# Altium schematic sheet SCH - Inputs and Intermediary.SchDoc: *f
size A4; CompanyName: James Cook University; DrawnBy1: Jacob Finger; Organization: James Cook University; Title1: AS1 SCH - Input & Intermediaries; Revision: 1.2; SheetNumber: 1; SheetTotal: 3; Title2: Conx, Headers, MCU & Flash; DrawnBy2: Liam McLaren; ProjectName: *ProjectName
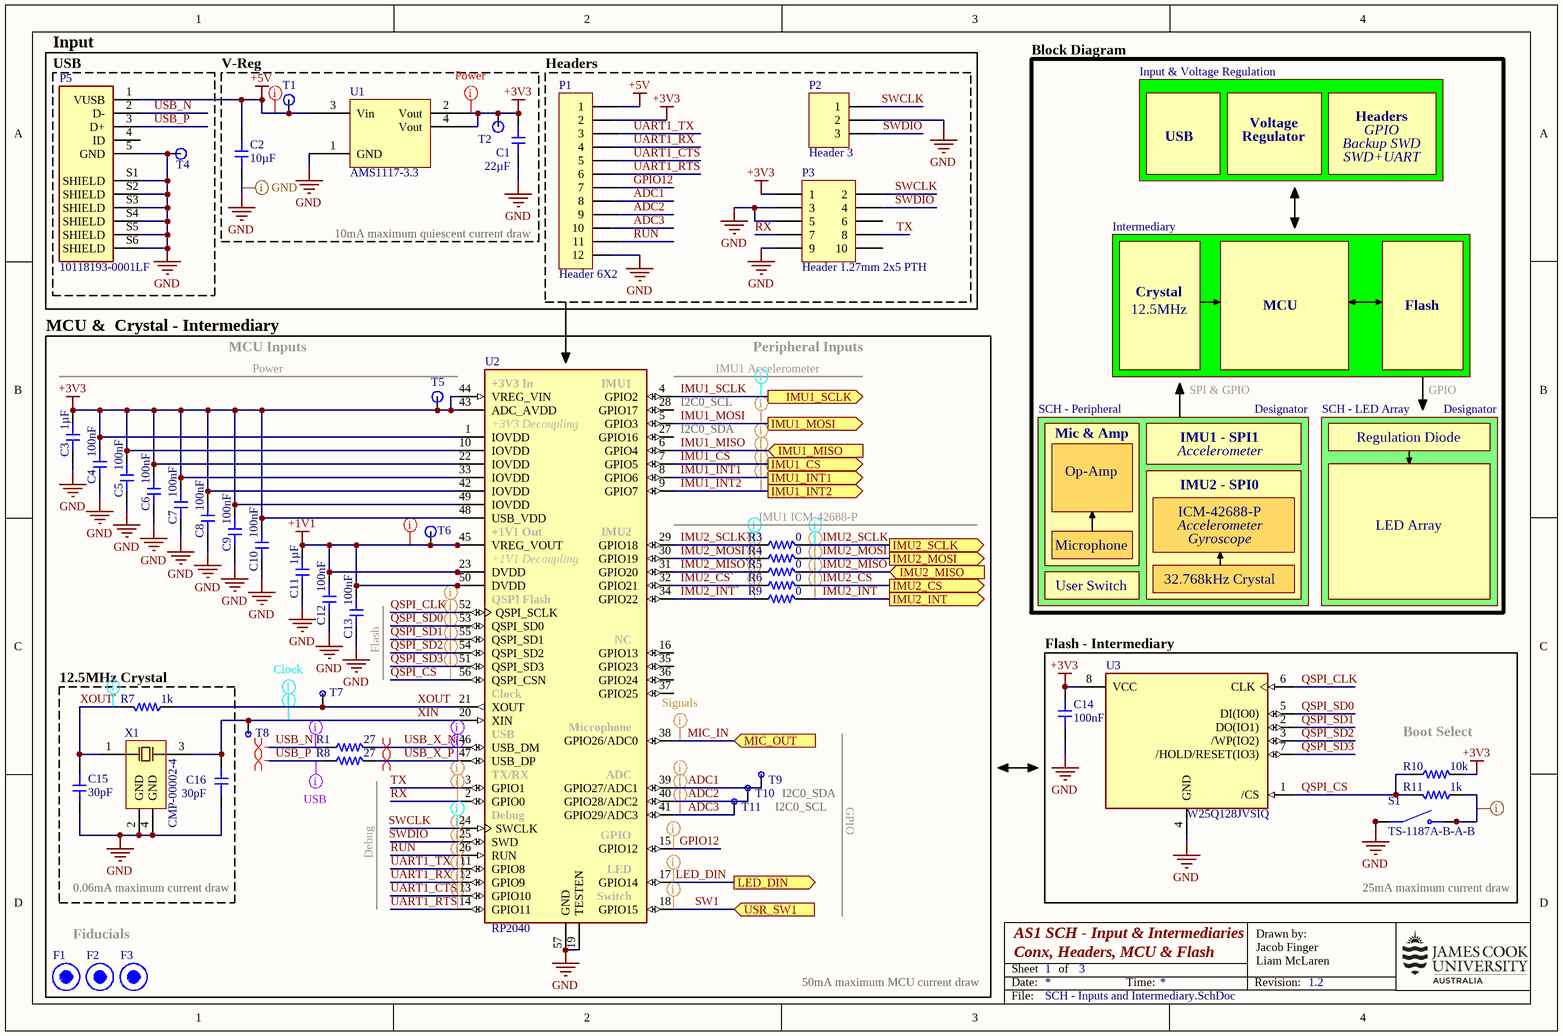
[diagram p0: SCH - Inputs and Intermediary.SchDoc]

## Parts
C1  value 22µF  [CAP-0603]  (hidden comment: CL10A226MQ8NRNC)
C2  value 10µF  [CAP-0402]  (hidden comment: CL05A106MQ5NUNC)
C3  value 1µF  [CAP-0402]  (hidden comment: CL05A105KA5NQNC)
C4  value 100nF  [CAP-0402]  (hidden comment: CL05B104KB54PNC)
C5  value 100nF  [CAP-0402]  (hidden comment: CL05B104KB54PNC)
C6  value 100nF  [CAP-0402]  (hidden comment: CL05B104KB54PNC)
C7  value 100nF  [CAP-0402]  (hidden comment: CL05B104KB54PNC)
C8  value 100nF  [CAP-0402]  (hidden comment: CL05B104KB54PNC)
C9  value 100nF  [CAP-0402]  (hidden comment: CL05B104KB54PNC)
C10  value 100nF  [CAP-0402]  (hidden comment: CL05B104KB54PNC)
C11  value 1µF  [CAP-0402]  (hidden comment: CL05A105KA5NQNC)
C12  value 100nF  [CAP-0402]  (hidden comment: CL05B104KB54PNC)
C13  value 100nF  [CAP-0402]  (hidden comment: CL05B104KB54PNC)
C14  value 100nF  [CAP-0402]  (hidden comment: CL05B104KB54PNC)
C15  value 30pF  [CAP-0603]  (hidden comment: 0603CG300J500NT)
C16  value 30pF  [CAP-0603]  (hidden comment: 0603CG300J500NT)
F1  Fiducial Pad  [Fiducial]  (value not drawn)  (no BOM)
F2  Fiducial Pad  [Fiducial]  (value not drawn)  (no BOM)
F3  Fiducial Pad  [Fiducial]  (value not drawn)  (no BOM)
P1  Header 6X2  [HDR2X6]  (no BOM)
P2  Header 3  [HDR1X3]  (no BOM)
P3  Header 1.27mm 2x5 PTH  [Header 1.27mm 2x5 PTH]  (no BOM)
P5  10118193-0001LF  [FCI_10118193-0001LF]
R1  value 27  [RES-0603]  (hidden comment: 0603WAF270JT5E)
R3  value 0  [RES-0402]  (hidden comment: 0402WGF0000TCE)
R4  value 0  [RES-0402]  (hidden comment: 0402WGF0000TCE)
R5  value 0  [RES-0402]  (hidden comment: 0402WGF0000TCE)
R6  value 0  [RES-0402]  (hidden comment: 0402WGF0000TCE)
R7  value 1k  [RES-0402]  (hidden comment: 0402WGF1001TCE)
R8  value 27  [RES-0603]  (hidden comment: 0603WAF270JT5E)
R9  value 0  [RES-0402]  (hidden comment: 0402WGF0000TCE)
R10  value 10k  [RES-0402]  (hidden comment: 0402WGF1002TCE)
R11  value 1k  [RES-0402]  (hidden comment: 0402WGF1001TCE)
S1  TS-1187A-B-A-B  [SW_TS-1187A-B-A-B]
T1  TP  [TestPoint]  (value not drawn)  (no BOM)
T2  TP  [TestPoint]  (value not drawn)  (no BOM)
T4  TP  [TestPoint]  (value not drawn)  (no BOM)
T5  TP  [TestPoint]  (value not drawn)  (no BOM)
T6  TP  [TestPoint]  (value not drawn)  (no BOM)
T7  TP  [TestPoint - Small]  (value not drawn)  (no BOM)
T8  TP  [TestPoint - Small]  (value not drawn)  (no BOM)
T9  TP  [TestPoint - Small]  (value not drawn)  (no BOM)
T10  TP  [TestPoint - Small]  (value not drawn)  (no BOM)
T11  TP  [TestPoint - Small]  (value not drawn)  (no BOM)
U1  AMS1117-3.3  [SOT230P700X180-4N]
U2  RP2040  [QFN40P700X700X90-57N]
U3  W25Q128JVSIQ  [SOIC127P790X216-8N]
X1  CMP-00002-4  [X322512MSB4SI-Footprint-1]

## Blocks framed on the sheet
USB: P5 T4
V-Reg: C1 C2 T1 T2 U1
Headers: P1-P3
MCU &  Crystal - Intermediary: C3-C13 F1-F3 R1 R3-R6 R8 R9 T5-T11 U2
12.5MHz Crystal: C15 C16 R7 X1

## Sub-sheets
Designator = SCH - Peripheral: no entries
Designator = SCH - LED Array: no entries

## Ports
IMU1_CS (out, see SCH - Peripheral[4A]), IMU1_INT1 (out, see SCH - Peripheral[4B]), IMU1_INT2 (out, see SCH - Peripheral[4B]), IMU1_MISO (in, see SCH - Peripheral[4B]), IMU1_MOSI (out, see SCH - Peripheral[4A]), IMU1_SCLK (out, see SCH - Peripheral[4A]), IMU2_CS (out, see SCH - Peripheral[4C]), IMU2_INT (out, see SCH - Peripheral[3C]), IMU2_MISO (in, see SCH - Peripheral[4C]), IMU2_MOSI (out, see SCH - Peripheral[4C]), IMU2_SCLK (out, see SCH - Peripheral[4C]), LED_DIN (out, see SCH - LED Array[1A]), MIC_OUT (in, see SCH - Peripheral[2A]), USR_SW1 (in, see SCH - Peripheral[1C])

## Nets
+1V1: C11.1 C12.2 C13.2 T6.1(TP) U2.23(DVDD) U2.45(VREG_VOUT) U2.50(DVDD)
+3V3: C1.2 C3.2 C4.2 C5.2 C6.2 C7.2 C8.2 C9.2 C10.2 C14.2 P1.2 P3.1 R10.2 T2.1(TP) T5.1(TP) U1.2(Vout) U1.4(Vout) U2.1(IOVDD) U2.10(IOVDD) U2.22(IOVDD) U2.33(IOVDD) U2.42(IOVDD) U2.43(ADC_AVDD) U2.44(VREG_VIN) U2.48(USB_VDD) U2.49(IOVDD) U3.8(VCC)
+5V: C2.2 P1.1 P5.1(VUSB) T1.1(TP) U1.3(Vin)
GND: C1.1 C2.1 C3.1 C4.1 C5.1 C6.1 C7.1 C8.1 C9.1 C10.1 C11.2 C12.1 C13.1 C14.1 C15.1 C16.1 P1.12 P2.2 P3.3 P3.5 P3.9 P5.5(GND) P5.S1(SHIELD) P5.S2(SHIELD) P5.S3(SHIELD) P5.S4(SHIELD) P5.S5(SHIELD) P5.S6(SHIELD) S1.A(COM) S1.B(COM) T4.1(TP) U1.1(GND) U2.19(TESTEN) U2.57(GND) U3.4(GND) X1.2(GND) X1.4(GND)
ADC1: P1.8 T9.1(TP) U2.39(GPIO27/ADC1)
ADC2: P1.9 T10.1(TP) U2.40(GPIO28/ADC2)
ADC3: P1.10 T11.1(TP) U2.41(GPIO29/ADC3)
GPIO12: P1.7 U2.15(GPIO12)
IMU1_CS: U2.7(GPIO5) ; port IMU1_CS
IMU1_INT1: U2.8(GPIO6) ; port IMU1_INT1
IMU1_INT2: U2.9(GPIO7) ; port IMU1_INT2
IMU1_MISO: U2.6(GPIO4) ; port IMU1_MISO
IMU1_MOSI: U2.5(GPIO3) ; port IMU1_MOSI
IMU1_SCLK: U2.4(GPIO2) ; port IMU1_SCLK
IMU2_CS: R6.2 ; port IMU2_CS
IMU2_CS`: R6.1 U2.32(GPIO21)
IMU2_INT: R9.2 ; port IMU2_INT
IMU2_INT`: R9.1 U2.34(GPIO22)
IMU2_MISO: R5.2 ; port IMU2_MISO
IMU2_MISO`: R5.1 U2.31(GPIO20)
IMU2_MOSI: R4.2 ; port IMU2_MOSI
IMU2_MOSI`: R4.1 U2.30(GPIO19)
IMU2_SCLK: R3.2 ; port IMU2_SCLK
IMU2_SCLK`: R3.1 U2.29(GPIO18)
LED_DIN: U2.17(GPIO14) ; port LED_DIN
MIC_IN: U2.38(GPIO26/ADC0) ; port MIC_OUT
QSPI_CLK: U2.52(QSPI_SCLK) U3.6(CLK)
QSPI_CS: R10.1 R11.2 U2.56(QSPI_CSN) U3.1(/CS)
QSPI_SD0: U2.53(QSPI_SD0) U3.5(DI(IO0))
QSPI_SD1: U2.55(QSPI_SD1) U3.2(DO(IO1))
QSPI_SD2: U2.54(QSPI_SD2) U3.3(/WP(IO2))
QSPI_SD3: U2.51(QSPI_SD3) U3.7(/HOLD/RESET(IO3))
RUN: P1.11 U2.26(RUN)
RX: P3.7 U2.2(GPIO0)
SW1: U2.18(GPIO15) ; port USR_SW1
SWCLK: P2.1 P3.2 U2.24(SWCLK)
SWDIO: P2.3 P3.4 U2.25(SWD)
TX: P3.8 U2.3(GPIO1)
UART1_CTS: P1.5 U2.13(GPIO10)
UART1_RTS: P1.6 U2.14(GPIO11)
UART1_RX: P1.4 U2.12(GPIO9)
UART1_TX: P1.3 U2.11(GPIO8)
USB_N: P5.2(D-) R1.1
USB_P: P5.3(D+) R8.1
USB_X_N: R1.2 U2.46(USB_DM)
USB_X_P: R8.2 U2.47(USB_DP)
XIN: C16.2 T8.1(TP) U2.20(XIN) X1.3(OSC2)
XOUT: R7.1 T7.1(TP) U2.21(XOUT)
XOUT`: C15.2 R7.2 X1.1(OSC1)
NetR11_1: R11.1 S1.C(NO) S1.D(NO)

Not connected (* = marked no-connect by the designer): P3 6 10; P5 4(ID); U2 16(GPIO13) 27(GPIO16) 28(GPIO17) 35(GPIO23) 36(GPIO24) 37(GPIO25)

## Layout directives
differential pair: USB_N, USB_P, USB_X_N, USB_X_P
net class Power: +1V1, +3V3, +5V
net class Signals: ADC1, ADC2, ADC3, GPIO12, IMU1_CS, IMU1_INT1, IMU1_INT2, IMU1_MISO, IMU1_MOSI, IMU2_CS, IMU2_CS`, IMU2_INT, IMU2_INT`, IMU2_MISO, IMU2_MISO`, IMU2_MOSI, IMU2_MOSI`, LED_DIN, MIC_IN, RUN, RX, SW1, SWDIO, TX, UART1_CTS, UART1_RTS, UART1_RX, UART1_TX
net class QSPI: QSPI_CLK, QSPI_CS, QSPI_SD0, QSPI_SD1, QSPI_SD2, QSPI_SD3
net class Clock: IMU1_SCLK, IMU2_SCLK, IMU2_SCLK`, SWCLK, XIN, XOUT, XOUT`
net class GND: GND, NetR11_1
net class USB: USB_N, USB_P, USB_X_N, USB_X_P

## Notes on the sheet
- (near P5) Input
- Block Diagram
- Input & Voltage Regulation
- Voltage
- Headers
- GPIO
- USB
- Regulator
- Backup SWD
- SWD+UART
- 10mA maximum quiescent current draw
- Intermediary
- Crystal
- 12.5MHz
- MCU
- Flash
- MCU Inputs
- Power
- IMU1 Accelerometer
- Peripheral Inputs
- SPI & GPIO
- (near U2) I2C0_SDA
- (near U2) I2C0_SCL
- Mic & Amp
- IMU1 - SPI1
- Accelerometer
- Regulation Diode
- IMU1 ICM-42688-P
- Op-Amp
- IMU2 - SPI0
- ICM-42688-P
- LED Array
- User Switch
- Microphone
- 32.768kHz Crystal
- Gyroscope
- (near C13) Flash
- Flash - Intermediary
- Boot Select
- Debug
- I2C0_SCL
- I2C0_SDA
- 0.06mA maximum current draw
- 25mA maximum current draw
- Fiducials
- 50mA maximum MCU current draw
- Date:
- Sheet
- of
- Time:
- Revision:
- Drawn by:
- File:
- (in symbol CMP-043-000000-5) +3V3 In; IMU1; +3V3 Decoupling; +1V1 Out; IMU2; +1V1 Decoupling; QSPI Flash; NC; Clock; Microphone; USB; TX/RX; ADC; Debug; GPIO; LED; Switch

## Library data of the parts
C1 = CMP-001-00157-2: Capacitor, Ceramic (MLCC), 22uF, ±20%, 6.3V, X5R, ±20%, SMD 0603; Manufacturer: Samsung Electro-Mechanics; Manufacturer Part Number: CL10A226MQ8NRNC; JLCPCB Basic Part: Yes; ComponentLink1Description: Datasheet; ComponentLink2URL: https://jlcpcb.com/partdetail/C59461; ComponentLink3Description: LCSC Part URL; Case/Package: 0603; ComponentLink1URL: https://datasheet.lcsc.com/lcsc/1811151138_Samsung-Electro-Mechanics-CL10A226MQ8NRNC_C59461.pdf; Voltage Rating: 6.3V; Category: Capacitors - MLCC; Design Item ID: CL10A226MQ8NRNC; Source: jlcpcb_capacitors_basic.schlib; ComponentLink3URL: https://lcsc.com/product-detail/Multilayer-Ceramic-Capacitors-MLCC---SMD-SMT_Samsung-Electro-Mechanics-Samsung-Electro-Mechanics-CL10A226MQ8NRNC_C59461.html; ComponentLink2Description: JLCPCB Part URL; RoHS: Yes; JLCPCB Part Number: C59461; Tolerance: 20%; Temperature Coefficient: X5R
C2 = CMP-001-00141-3: Capacitor, Ceramic (MLCC), 10uF, ±20%, 6.3V, X5R, ±20%, SMD 0402; Manufacturer: Samsung Electro-Mechanics; JLCPCB Part Number: C15525; Tolerance: 20%; Temperature Coefficient: X5R; ComponentLink2Description: JLCPCB Part URL; ComponentLink3Description: LCSC Part URL; Voltage Rating: 6.3V; ComponentLink1Description: Datasheet; ComponentLink1URL: https://datasheet.lcsc.com/lcsc/2208231630_Samsung-Electro-Mechanics-CL05A106MQ5NUNC_C15525.pdf; RoHS: Yes; Case/Package: 0402; ComponentLink2URL: https://jlcpcb.com/partdetail/C15525; Manufacturer Part Number: CL05A106MQ5NUNC; Design Item ID: CL05A106MQ5NUNC; Source: jlcpcb_capacitors_basic.schlib; Category: Capacitors - MLCC; ComponentLink3URL: https://lcsc.com/product-detail/Multilayer-Ceramic-Capacitors-MLCC---SMD-SMT_Samsung-Electro-Mechanics-Samsung-Electro-Mechanics-CL05A106MQ5NUNC_C15525.html; JLCPCB Basic Part: Yes
C3 C11 = CMP-001-00140-3: Capacitor, Ceramic (MLCC), 1uF, ±10%, 25V, X5R, ±10%, SMD 0402; Manufacturer: Samsung Electro-Mechanics; Case/Package: 0402; JLCPCB Basic Part: Yes; ComponentLink2URL: https://jlcpcb.com/partdetail/C52923; Source: jlcpcb_capacitors_basic.schlib; ComponentLink1URL: https://datasheet.lcsc.com/lcsc/1811091611_Samsung-Electro-Mechanics-CL05A105KA5NQNC_C52923.pdf; RoHS: Yes; ComponentLink2Description: JLCPCB Part URL; Temperature Coefficient: X5R; ComponentLink3Description: LCSC Part URL; Category: Capacitors - MLCC; Voltage Rating: 25V; Tolerance: 10%; Design Item ID: CL05A105KA5NQNC; ComponentLink3URL: https://lcsc.com/product-detail/Multilayer-Ceramic-Capacitors-MLCC---SMD-SMT_Samsung-Electro-Mechanics-Samsung-Electro-Mechanics-CL05A105KA5NQNC_C52923.html; Manufacturer Part Number: CL05A105KA5NQNC; JLCPCB Part Number: C52923; ComponentLink1Description: Datasheet
C4-C10 C12-C14 = CMP-001-00146-3: Capacitor, Ceramic (MLCC), 100nF, ±10%, 50V, X7R, ±10%, SMD 0402; Manufacturer: Samsung Electro-Mechanics; Design Item ID: CL05B104KB54PNC; Source: jlcpcb_capacitors_basic.schlib; Case/Package: 0402; Temperature Coefficient: X7R; ComponentLink3URL: https://lcsc.com/product-detail/Multilayer-Ceramic-Capacitors-MLCC---SMD-SMT_Samsung-Electro-Mechanics-Samsung-Electro-Mechanics-CL05B104KB54PNC_C307331.html; Manufacturer Part Number: CL05B104KB54PNC; RoHS: Yes; ComponentLink1Description: Datasheet; Voltage Rating: 50V; ComponentLink2Description: JLCPCB Part URL; JLCPCB Basic Part: Yes; Category: Capacitors - MLCC; ComponentLink3Description: LCSC Part URL; ComponentLink2URL: https://jlcpcb.com/partdetail/C307331; JLCPCB Part Number: C307331; Tolerance: 10%; ComponentLink1URL: https://datasheet.lcsc.com/lcsc/1810191222_Samsung-Electro-Mechanics-CL05B104KB54PNC_C307331.pdf
C15 C16 = CMP-001-00132-2: Capacitor, Ceramic (MLCC), 30pF, ±5%, 50V, C0G, ±5%, SMD 0603; Manufacturer: FH(Guangdong Fenghua Advanced Tech); Voltage Rating: 50V; ComponentLink3URL: https://lcsc.com/product-detail/Multilayer-Ceramic-Capacitors-MLCC---SMD-SMT_FH-Guangdong-Fenghua-Advanced-Tech-FH-Guangdong-Fenghua-Advanced-Tech-0603CG300J500NT_C1658.html; JLCPCB Part Number: C1658; ComponentLink3Description: LCSC Part URL; Tolerance: 5%; ComponentLink2Description: JLCPCB Part URL; Category: Capacitors - MLCC; ComponentLink2URL: https://jlcpcb.com/partdetail/C1658; JLCPCB Basic Part: Yes; Source: jlcpcb_capacitors_basic.schlib; Temperature Coefficient: C0G; Case/Package: 0603; ComponentLink1URL: https://datasheet.lcsc.com/lcsc/1810261611_FH--Guangdong-Fenghua-Advanced-Tech-0603CG300J500NT_C1658.pdf; ComponentLink1Description: Datasheet; Design Item ID: 0603CG300J500NT; RoHS: Yes; Manufacturer Part Number: 0603CG300J500NT
F1-F3 = Fiducial: 1x2mm Fiducial Pad; ClassName: Fiducial; Component Class name: Fiducial
P1 = CMP-002-00136-1: Header, 6-Pin, Dual row; Signal Integrity: Connector; Component Type: Standard; LatestRevisionNote: Re-released for DXP Platform.; Publisher: Altium Limited; Design Item ID: Header 6X2; LatestRevisionDate: 17-Jul-2002; Pin Count: 12; Source: Miscellaneous Connectors.SchLib
P2 = CMP-002-00117-1: Header, 3-Pin; Signal Integrity: Connector; Design Item ID: Header 3; LatestRevisionDate: 17-Jul-2002; Publisher: Altium Limited; Component Type: Standard; Pin Count: 3; Source: Miscellaneous Connectors.SchLib; LatestRevisionNote: Re-released for DXP Platform.
P3 = CMP-005-0002-2: Header 1.27mm pitch, 2x5, PTH through hole; Pins: 10; element14 Item: 1577743; Design Item ID: Header 1.27mm 2x5 PTH; Source: JCULibrary.SchLib; Component Type: Standard
P5 = CMP-045-000000-8: USB - micro B USB 2.0 Receptacle Connector 5 Position Surface Mount, Right Angle; Through Hole; MF: Amphenol ICC; MP: 10118193-0001LF; Component Type: Standard; Design Item ID: 10118193-0001LF; JLCPCB Part: C132562; Pin Count: 11; Package: None; Source: SnapEDAsch.SchLib; SnapEDA_Link: https://www.snapeda.com/parts/10118193-0001LF/Amphenol%20FCI/view-part/2758989/?ref=snap
R1 R8 = CMP-009-00289-2: Resistor, 27Ω, ±1%, 100mW, 75V, ±200ppm/℃, -55℃~+155℃, SMD 0603; Manufacturer: Uniroyal; Design Item ID: 0603WAF270JT5E; Temperature Coefficient: ±200ppm/℃; ComponentLink1URL: https://datasheet.lcsc.com/lcsc/2205311845_UNI-ROYAL-Uniroyal-Elec-0603WAF270JT5E_C25190.pdf; ComponentLink2URL: https://jlcpcb.com/partdetail/C25190; Power Rating: 100mW; JLCPCB Part Number: C25190; Manufacturer Part Number: 0603WAF270JT5E; Source: jlcpcb_resistors_basic.schlib; Voltage Rating: 75V; Tolerance: 1%; Case/Package: 0603; Temperature Rating: -55℃~+155℃; ComponentLink1Description: Datasheet; Category: Resistors; ComponentLink2Description: JLCPCB Part URL; JLCPCB Basic Part: Yes
R3-R6 R9 = CMP-009-00178-4: Resistor, 0Ω, ±1%, 62.5mW, 50V, ±800ppm/℃, -55℃~+155℃, SMD 0402; Manufacturer: Uniroyal; JLCPCB Part Number: C17168; Tolerance: 1%; Temperature Coefficient: ±800ppm/℃; ComponentLink1Description: Datasheet; ComponentLink1URL: https://datasheet.lcsc.com/lcsc/2206010216_UNI-ROYAL-Uniroyal-Elec-0402WGF0000TCE_C17168.pdf; Manufacturer Part Number: 0402WGF0000TCE; Voltage Rating: 50V; Case/Package: 0402; ComponentLink2URL: https://jlcpcb.com/partdetail/C17168; Temperature Rating: -55℃~+155℃; ComponentLink2Description: JLCPCB Part URL; Power Rating: 62.5mW; Category: Resistors; Source: jlcpcb_resistors_basic.schlib; JLCPCB Basic Part: Yes; Design Item ID: 0402WGF0000TCE
R7 R11 = CMP-009-00180-4: Resistor, 1kΩ, ±1%, 62.5mW, 50V, ±100ppm/℃, -55℃~+155℃, SMD 0402; Manufacturer: Uniroyal; Temperature Coefficient: ±100ppm/℃; JLCPCB Part Number: C11702; ComponentLink2URL: https://jlcpcb.com/partdetail/C11702; Power Rating: 62.5mW; JLCPCB Basic Part: Yes; ComponentLink2Description: JLCPCB Part URL; ComponentLink1URL: https://datasheet.lcsc.com/lcsc/2206010216_UNI-ROYAL-Uniroyal-Elec-0402WGF1001TCE_C11702.pdf; Temperature Rating: -55℃~+155℃; Manufacturer Part Number: 0402WGF1001TCE; ComponentLink1Description: Datasheet; Tolerance: 1%; Source: jlcpcb_resistors_basic.schlib; Design Item ID: 0402WGF1001TCE; Case/Package: 0402; Voltage Rating: 50V; Category: Resistors
R10 = CMP-009-00181-4: Resistor, 10kΩ, ±1%, 62.5mW, 50V, ±100ppm/℃, -55℃~+155℃, SMD 0402; Manufacturer: Uniroyal; ComponentLink1Description: Datasheet; JLCPCB Basic Part: Yes; Temperature Rating: -55℃~+155℃; Power Rating: 62.5mW; ComponentLink2URL: https://jlcpcb.com/partdetail/C25744; ComponentLink2Description: JLCPCB Part URL; Case/Package: 0402; Voltage Rating: 50V; ComponentLink1URL: https://datasheet.lcsc.com/lcsc/2206010100_UNI-ROYAL-Uniroyal-Elec-0402WGF1002TCE_C25744.pdf; Source: jlcpcb_resistors_basic.schlib; Category: Resistors; Design Item ID: 0402WGF1002TCE; Temperature Coefficient: ±100ppm/℃; JLCPCB Part Number: C25744; Tolerance: 1%; Manufacturer Part Number: 0402WGF1002TCE
S1 = CMP-015-000000-1: SPST 50mA @ 12VDC Top Actuated Round Button 160gf SMD Tactile Switches RoHS; Availability: Unavailable; JLCPCB Part: C318884; Value: *; Price: None; Design Item ID: TS-1187A-B-A-B; Component Type: Standard; Pin Count: 4; Source: TS-1187A-B-A-B.SchLib; MP: TS-1187A-B-A-B; Package: None
T1 T2 T4-T6 = TestPoint
T7-T11 = TestPoint Small
U1 = CMP-00001-4: 3.3V 1A LOW DROPOUT VOLTAGE REGULATOR SOT-223; Dropout voltage: 1.3 V; JLCPCB Part: C6186; Output current: 1 A; Output voltage: 3.3 V
U2 = CMP-043-000000-5: ARM Cortex-M0+ MCU 32-Bit Microcontroller for Raspberry Pi Pico; Package: None; Price: None; Availability: Available; JLCPCB Part: C2040; Design Item ID: RP2040; Component Type: Standard; Pin Count: 57; Source: RP2040.SchLib; Value: *; MP: RP2040
U3 = CMP-031-00006-4: FLASH - NOR Memory IC 128Mb (16M x 8) SPI - Quad I/O, QPI, DTR 133 MHz 8-SOIC; MF: Winbond Electronics; Pin Count: 8; Check_prices: https://www.snapeda.com/parts/W25Q128JVSIQ/Winbond+Electronics/view-part/?ref=eda; Package: SOIC-8 Winbond; MP: W25Q128JVSIQ; Component Type: Standard; JLCPCB Part: C97521; Source: W25Q128JVSIQ.SchLib; Design Item ID: W25Q128JVSIQ; Purchase-URL: https://pricing.snapeda.com/search/part/W25Q128JVSIQ/?ref=eda; Price: None; Availability: In Stock; SnapEDA_Link: https://www.snapeda.com/parts/W25Q128JVSIQ/Winbond+Electronics/view-part/?ref=snap; Value: *
X1 = CMP-003-00030-1: 12MHz SMD Crystal Resonator 20pF ±10ppm ±30ppm -40℃~+85℃ SMD3225-4P  Crystals ROHS Yangxing Tech; Max ESR: 80 Ω; Design Item ID: CMP-00002-4; Source: SCH_LIB_Assignment1.SchLib; Load Capacitance: 20pF; Frequency: 12MHz; JLCPCB Part: C9002